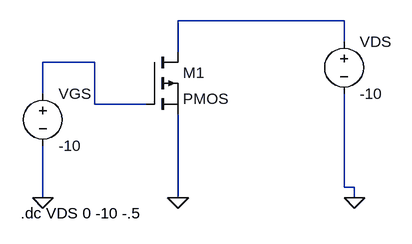
[diagram p0: schematic Draft4.asc]
Draft4.asc, the LTspice schematic file:
Version 4
SHEET 1 880 680
WIRE 464 32 208 32
WIRE 464 64 464 32
WIRE 208 80 208 32
WIRE 80 96 0 96
WIRE 0 144 0 96
WIRE 80 160 80 96
WIRE 160 160 80 160
WIRE 464 288 464 144
WIRE 480 288 464 288
WIRE 0 304 0 224
WIRE 208 304 208 176
WIRE 480 304 480 288
FLAG 0 304 0
FLAG 208 304 0
FLAG 480 304 0
SYMBOL pmos 160 80 R0
SYMATTR InstName M1
SYMBOL voltage 0 128 R0
SYMATTR InstName VGS
SYMATTR Value -10
SYMBOL voltage 464 48 R0
SYMATTR InstName VDS
SYMATTR Value -10
TEXT -34 328 Left 2 !.dc VDS 0 -10 -.5

The netlist it stands for:
* Draft4.asc
M1 N001 N002 0 0 PMOS
VGS N002 0 -10
VDS N001 0 -10
.model NMOS NMOS
.model PMOS PMOS
.lib standard.mos
.dc VDS 0 -10 -.5
.backanno
.end